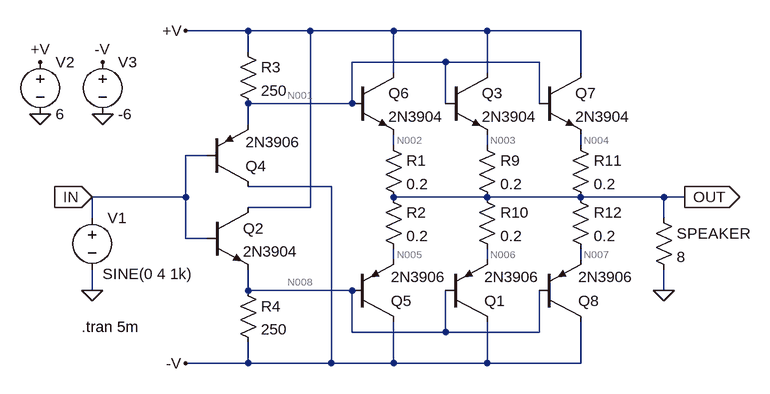
[diagram p0: schematic Circuit7_12.asc]
Circuit7_12.asc, the LTspice schematic file:
Version 4
SHEET 1 2568 680
WIRE 160 80 64 80
WIRE 256 80 160 80
WIRE 384 80 256 80
WIRE 528 80 384 80
WIRE 672 80 528 80
WIRE 160 112 160 80
WIRE 464 128 320 128
WIRE 608 128 464 128
WIRE 384 144 384 80
WIRE 528 144 528 80
WIRE 672 144 672 80
WIRE 320 192 320 128
WIRE 320 192 160 192
WIRE 464 192 464 128
WIRE 608 192 608 128
WIRE 160 224 160 192
WIRE 384 256 384 240
WIRE 528 256 528 240
WIRE 672 256 672 240
WIRE 96 272 64 272
WIRE 288 320 160 320
WIRE 64 336 64 272
WIRE 64 336 -80 336
WIRE 528 336 384 336
WIRE 672 336 528 336
WIRE 800 336 672 336
WIRE 832 336 800 336
WIRE 256 352 256 80
WIRE 256 352 160 352
WIRE -80 368 -80 336
WIRE 800 368 800 336
WIRE 64 400 64 336
WIRE 96 400 64 400
WIRE 384 432 384 416
WIRE 528 432 528 416
WIRE 672 432 672 416
WIRE -80 480 -80 448
WIRE 160 480 160 448
WIRE 320 480 160 480
WIRE 800 480 800 448
WIRE 320 544 320 480
WIRE 464 544 464 480
WIRE 464 544 320 544
WIRE 608 544 608 480
WIRE 608 544 464 544
WIRE 160 592 160 560
WIRE 160 592 64 592
WIRE 288 592 288 320
WIRE 288 592 160 592
WIRE 384 592 384 528
WIRE 384 592 288 592
WIRE 528 592 528 528
WIRE 528 592 384 592
WIRE 672 592 672 528
WIRE 672 592 528 592
FLAG 64 80 +V
FLAG 64 592 -V
FLAG -160 208 0
FLAG -64 208 0
FLAG -160 128 +V
FLAG -64 128 -V
FLAG 832 336 OUT
IOPIN 832 336 Out
FLAG 800 480 0
FLAG -80 480 0
FLAG -80 336 IN
IOPIN -80 336 In
SYMBOL npn 96 352 R0
SYMATTR InstName Q2
SYMATTR Value 2N3904
SYMBOL pnp 96 320 M180
WINDOW 0 60 32 Left 2
WINDOW 3 60 69 Left 2
SYMATTR InstName Q4
SYMATTR Value 2N3906
SYMBOL res 368 240 R0
SYMATTR InstName R1
SYMATTR Value 0.2
SYMBOL res 368 320 R0
SYMATTR InstName R2
SYMATTR Value 0.2
SYMBOL res 144 96 R0
SYMATTR InstName R3
SYMATTR Value 250
SYMBOL res 144 464 R0
SYMATTR InstName R4
SYMATTR Value 250
SYMBOL voltage -160 112 R0
SYMATTR InstName V2
SYMATTR Value 6
SYMBOL voltage -64 112 R0
SYMATTR InstName V3
SYMATTR Value -6
SYMBOL pnp 320 528 M180
WINDOW 0 60 32 Left 2
WINDOW 3 60 69 Left 2
SYMATTR InstName Q5
SYMATTR Value 2N3906
SYMBOL npn 320 144 R0
SYMATTR InstName Q6
SYMATTR Value 2N3904
SYMBOL res 784 352 R0
SYMATTR InstName SPEAKER
SYMATTR Value 8
SYMBOL voltage -80 352 R0
WINDOW 3 16 102 Left 2
WINDOW 123 24 38 Left 2
WINDOW 39 0 0 Left 0
SYMATTR Value SINE(0 4 1k)
SYMATTR InstName V1
SYMBOL res 512 240 R0
SYMATTR InstName R9
SYMATTR Value 0.2
SYMBOL res 512 320 R0
SYMATTR InstName R10
SYMATTR Value 0.2
SYMBOL pnp 464 528 M180
WINDOW 0 60 32 Left 2
WINDOW 3 60 69 Left 2
SYMATTR InstName Q1
SYMATTR Value 2N3906
SYMBOL npn 464 144 R0
SYMATTR InstName Q3
SYMATTR Value 2N3904
SYMBOL res 656 240 R0
SYMATTR InstName R11
SYMATTR Value 0.2
SYMBOL res 656 320 R0
SYMATTR InstName R12
SYMATTR Value 0.2
SYMBOL npn 608 144 R0
SYMATTR InstName Q7
SYMATTR Value 2N3904
SYMBOL pnp 608 528 M180
WINDOW 0 60 32 Left 2
WINDOW 3 60 69 Left 2
SYMATTR InstName Q8
SYMATTR Value 2N3906
TEXT -96 536 Left 2 !.tran 5m

The netlist it stands for:
* Circuit7_12.asc
Q2 +V IN N008 0 2N3904
Q4 -V IN N001 0 2N3906
R1 N002 OUT 0.2
R2 OUT N005 0.2
R3 +V N001 250
R4 N008 -V 250
V2 +V 0 6
V3 -V 0 -6
Q5 -V N008 N005 0 2N3906
Q6 +V N001 N002 0 2N3904
R§SPEAKER OUT 0 8
V1 IN 0 SINE(0 4 1k)
R9 N003 OUT 0.2
R10 OUT N006 0.2
Q1 -V N008 N006 0 2N3906
Q3 +V N001 N003 0 2N3904
R11 N004 OUT 0.2
R12 OUT N007 0.2
Q7 +V N001 N004 0 2N3904
Q8 -V N008 N007 0 2N3906
.model NPN NPN
.model PNP PNP
.lib standard.bjt
.tran 5m
.backanno
.end

* Results of the author's LTspice run, read from the files saved beside the schematic
* Operating Point, zero values left out:
*   V(+v) = 6 V
*   V(n008) = -736.7 mV
*   V(-v) = -6 V
*   V(n001) = 737.4 mV
*   V(n002) = 4.31 mV
*   V(out) = 636.5 µV
*   V(n005) = -3.032 mV
*   V(n003) = 4.31 mV
*   V(n006) = -3.032 mV
*   V(n004) = 4.31 mV
*   V(n007) = -3.032 mV
*   Ic(Q8) = -18.25 mA
*   Ib(Q8) = -90.45 µA
*   Ie(Q8) = 18.34 mA
*   Ic(Q1) = -18.25 mA
*   Ib(Q1) = -90.45 µA
*   Ie(Q1) = 18.34 mA
*   Ic(Q5) = -18.25 mA
*   Ib(Q5) = -90.45 µA
*   Ie(Q5) = 18.34 mA
*   Ic(Q4) = -20.77 mA
*   Ib(Q4) = -102.8 µA
*   Ie(Q4) = 20.87 mA
*   Ic(Q7) = 18.31 mA
*   Ib(Q7) = 60.49 µA
*   Ie(Q7) = -18.37 mA
*   Ic(Q3) = 18.31 mA
*   Ib(Q3) = 60.49 µA
*   Ie(Q3) = -18.37 mA
*   Ic(Q6) = 18.31 mA
*   Ib(Q6) = 60.49 µA
*   Ie(Q6) = -18.37 mA
*   Ic(Q2) = 20.71 mA
*   Ib(Q2) = 68.32 µA
*   Ie(Q2) = -20.78 mA
*   I(R12) = 18.34 mA
*   I(R11) = 18.37 mA
*   I(R10) = 18.34 mA
*   I(R9) = 18.37 mA
*   I(Speaker) = 79.56 µA
*   I(R4) = 21.05 mA
*   I(R3) = 21.05 mA
*   I(R2) = 18.34 mA
*   I(R1) = 18.37 mA
*   I(V1) = 34.43 µA
*   I(V3) = 96.57 mA
*   I(V2) = -96.69 mA
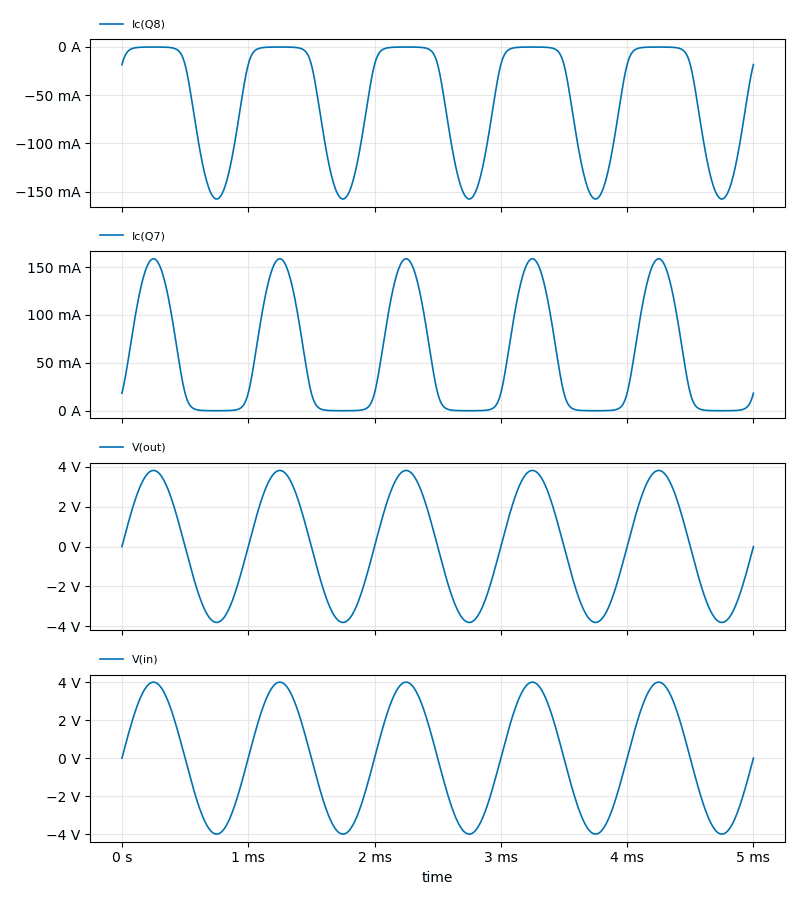
[diagram p1: Transient Analysis of Circuit7_12.asc, plotted from the saved traces]
* Transient Analysis, 1 run:
*   Ic(Q8): min -157.6 mA, max -65.14 µA, average -52.79 mA, rms 79.62 mA, last -18.25 mA
*   Ic(Q7): min 35.17 µA, max 158.7 mA, average 53.06 mA, rms 80.11 mA, last 18.31 mA
*   V(out): min -3.808 V, max 3.825 V, average 3.949 mV, rms 2.703 V, last 629.3 µV
*   V(in): min -4 V, max 4 V, average -850.5 nV, rms 2.828 V, last 0 V